# Altium schematic sheet aKaReZa75_eBoard_STM32F103C8__STM32F103C8__Supply.SchDoc: Supply
size A4; SheetNumber: 3; SheetTotal: 4
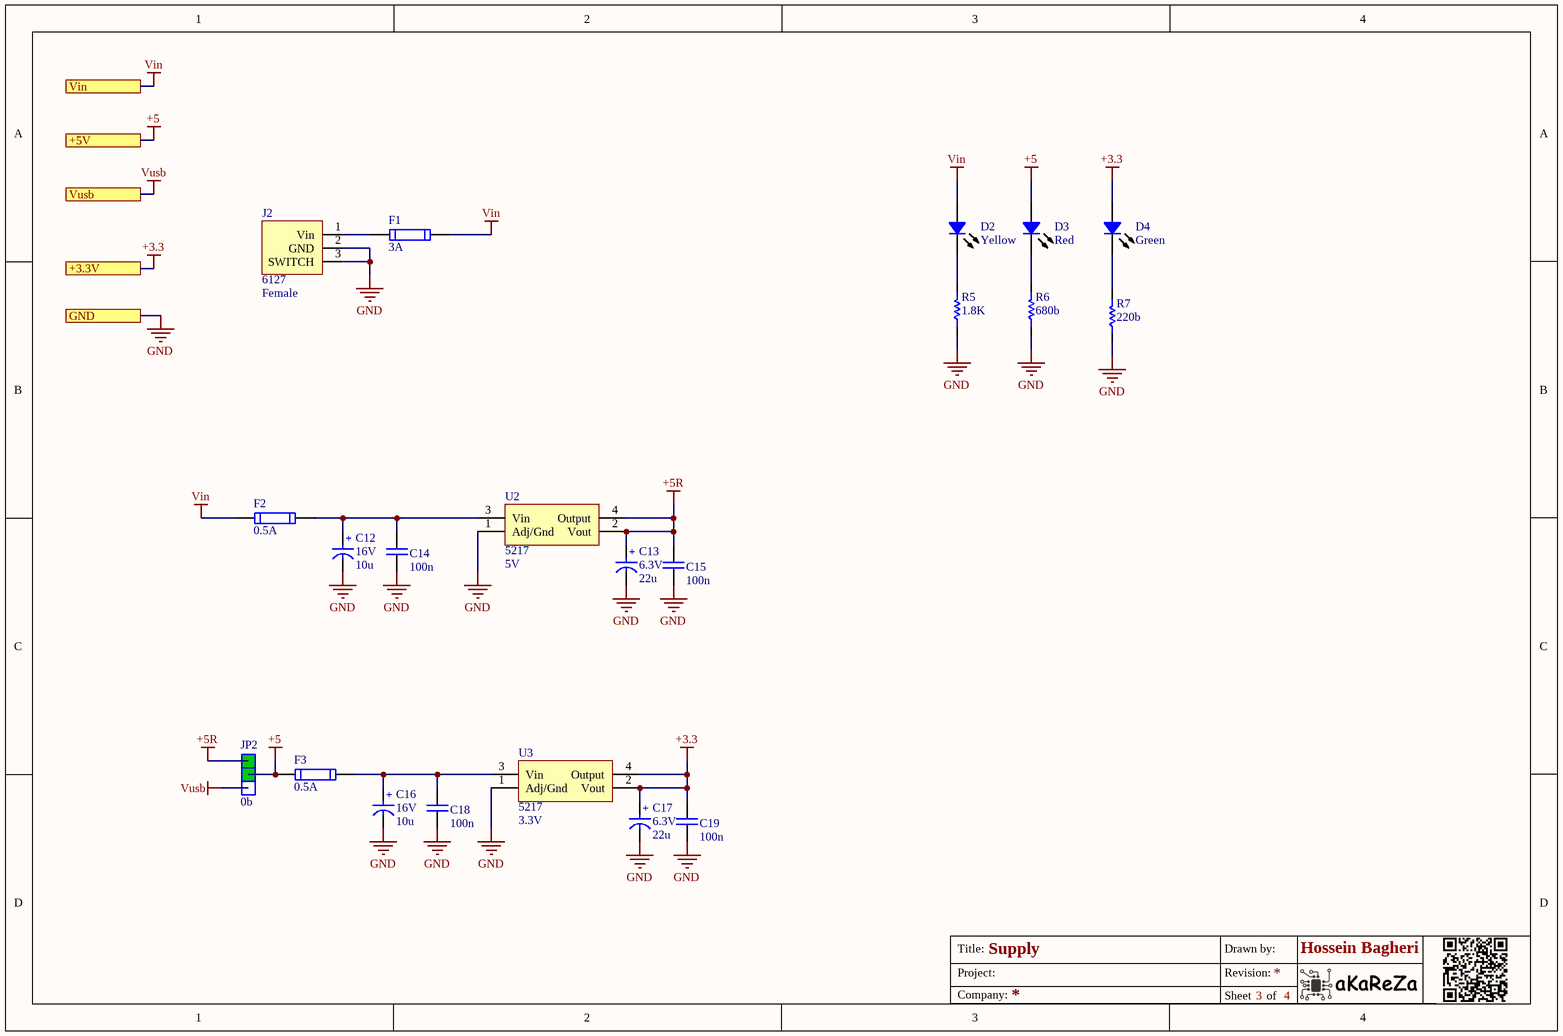
[diagram p0: aKaReZa75_eBoard_STM32F103C8__STM32F103C8__Supply.SchDoc]

## Parts
C12  Rating: 16V  [SMT_C_Tantalum_A]  (hidden comment: 10u)
C13  Rating: 6.3V  [SMT_C_Tantalum_A]  (hidden comment: 22u)
C14  100n  [CAP 1206/3216]
C15  100n  [CAP 1206/3216]
C16  Rating: 16V  [SMT_C_Tantalum_A]  (hidden comment: 10u)
C17  Rating: 6.3V  [SMT_C_Tantalum_A]  (hidden comment: 22u)
C18  100n  [CAP 1206/3216]
C19  100n  [CAP 1206/3216]
D2  Yellow  [LED 0805/2012 YELLOW]
D3  Red  [LED 0805/2012 RED]
D4  Green  [LED 0805/2012 GREEN]
F1  3A  [1206_F]
F2  0.5A  [1206_F]
F3  0.5A  [1206_F]
J2  Inflow: 6127  [Power Jack BIG]  (hidden comment: Female)
JP2  0b  [jumper selector]
R5  1.8K  [RES 0805 (2012X06L)]
R6  680b  [RES 0805 (2012X06L)]
R7  220b  [RES 0805 (2012X06L)]
U2  Inflow: 5217  [SOT223_M]  (hidden comment: 5V)
U3  Inflow: 5217  [SOT223_M]  (hidden comment: 3.3V)

## Ports
+3.3V, +5V, GND, Vin, Vusb

## Nets
+3.3: C17.1(+) C19.1 D4.1 U3.2(Vout) U3.4(Output) ; port +3.3V
+5: D3.1 F3.1 JP2.2 ; port +5V
+5R: C13.1(+) C15.1 JP2.1 U2.2(Vout) U2.4(Output)
GND: C12.2(-) C13.2(-) C14.2 C15.2 C16.2(-) C17.2(-) C18.2 C19.2 J2.2(GND) J2.3(SWITCH) R5.1 R6.1 R7.1 U2.1(Adj/Gnd) U3.1(Adj/Gnd) ; port GND
Vin: D2.1 F1.2 F2.1 ; port Vin
Vusb: JP2.3 ; port Vusb
NetC12_1: C12.1(+) C14.1 F2.2 U2.3(Vin)
NetC16_1: C16.1(+) C18.1 F3.2 U3.3(Vin)
NetD2_2: D2.2 R5.2
NetD3_2: D3.2 R6.2
NetD4_2: D4.2 R7.2
NetF1_1: F1.1 J2.1(Vin)

## Notes on the sheet
- Title:
- Project:
- Drawn by:
- Revision:
- Hossein Bagheri
- Company:
- Sheet
- of

## Library data of the parts
C12 C13 C16 C17 = Cap_Tantalum: Tantalum Capacitor,TAJ Series-SMD; Inflow: inflow?; Validation: Valid; Package: Package?; Type: Tantalum
  C12 C16: Value: 10u
  C13 C17: Value: 22u
C14 C15 C18 C19 = Cap_Multi_SMD_100nF_1206: Bipolar ceramic capacitor SMD; Type: MultiLayer; Inflow: inflow?; Rating: 50V; Validation: Valid; Package: 1206; Value: 100n
D2-D4 = Semi_LED_SMD: LED; Inflow: inflow?; Rating: Rating?; Validation: Valid; Package: Package?; Type: LED
  D2: Value: Yellow
  D3: Value: Red
  D4: Value: Green
F1-F3 = Other_Elec_Fuse_SMD: Short circiut  protection; Inflow: inflow?; Type: Fast; Rating: Rating?; Validation: Valid; Package: 1206
  F1: Value: 3A
  F2 F3: Value: 0.5A
J2 = Con_Power_Jack: Power Jack; Rating: Rating?; Validation: Valid; Type: Type?; Package: Package?; Value: Female
JP2 = SW_Other_JSelector_Dip: Jumper Selector; Rating: Rating?; Inflow: 5145; Validation: NT; Package: Dip; Type: Selector; Value: 0b
R5-R7 = Res_SMD_0805: Resistor; Inflow: inflow?; Rating: 0.125W; Validation: Valid; Package: 0805; Type: 10%
  R5: Value: 1.8K
  R6: Value: 680b
  R7: Value: 220b
U2 U3 = IC_Reg_AMS1117_3.3: 1'A Positive voltage regulator; Rating: 1A; Validation: Valid; Type: LDO; Package: SOT223
  U2: Value: 5V
  U3: Value: 3.3V